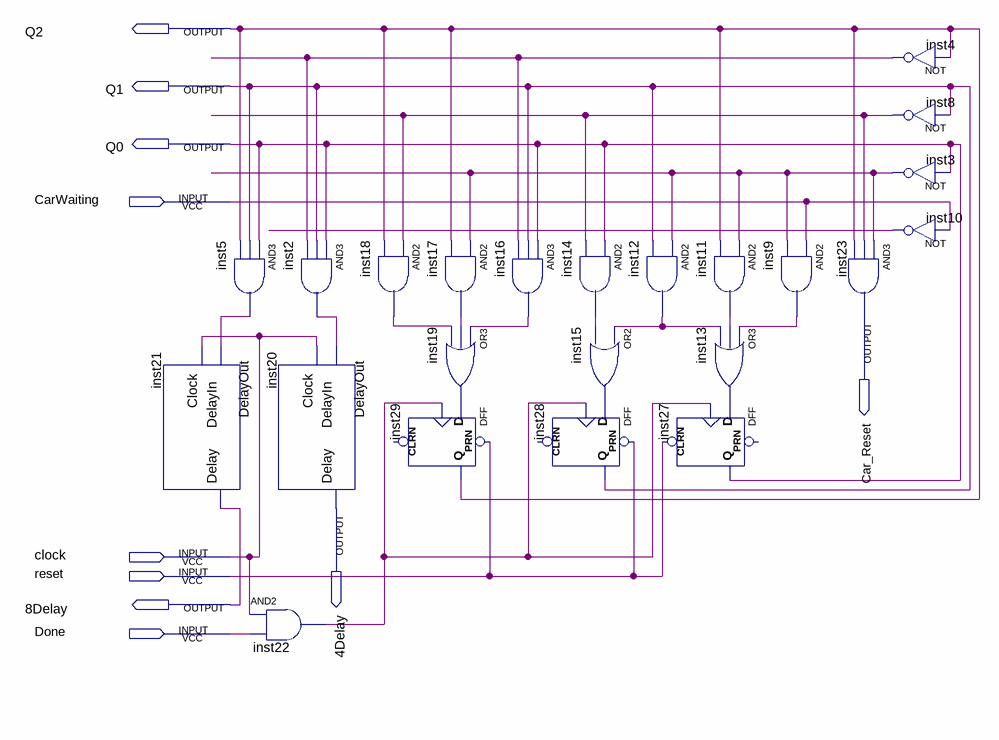
[diagram p0: schematic sheet]
// Quartus schematic TLC2.bdf as structural Verilog: 23 symbols, 10 pins
module TLC2 (
  input  CarWaiting,
  input  clock,
  input  reset,
  input  Done,
  output Q2,
  output Q1,
  output Q0,
  output Car_Reset,
  output \4Delay ,
  output \8Delay 
);

  wire inst2_out, inst3_out, inst4_out, inst5_out, inst8_out, inst9_out, inst10_out, inst11_out, inst12_out,
       inst13_out, inst14_out, inst15_out, inst16_out, inst17_out, inst18_out, inst19_out, inst22_out;

  DelayOut inst21 (.DelayIn(inst5_out), .Clock(clock), .Delay(\8Delay ));
  and inst5 (inst5_out, Q0, Q1, Q2);
  and inst2 (inst2_out, Q0, Q1, inst4_out);
  DelayOut inst20 (.DelayIn(inst2_out), .Clock(clock), .Delay(\4Delay ));
  and inst22 (inst22_out, clock, Done);
  and inst18 (inst18_out, inst8_out, Q2);
  DFF inst29 (.CLK(inst22_out), .D(inst19_out), .PRN(reset), .Q(Q2));  // open: CLRN
  and inst17 (inst17_out, inst3_out, Q2);
  or inst19 (inst19_out, inst16_out, inst17_out, inst18_out);
  and inst16 (inst16_out, Q0, Q1, inst4_out);
  DFF inst28 (.CLK(inst22_out), .D(inst15_out), .PRN(reset), .Q(Q1));  // open: CLRN
  and inst14 (inst14_out, Q0, inst8_out);
  or inst15 (inst15_out, inst12_out, inst14_out);
  and inst11 (inst11_out, inst3_out, Q2);
  and inst12 (inst12_out, inst3_out, Q1);
  or inst13 (inst13_out, inst9_out, inst11_out, inst12_out);
  DFF inst27 (.CLRN(reset), .CLK(inst22_out), .D(inst13_out), .Q(Q0));  // open: PRN
  and inst9 (inst9_out, CarWaiting, inst3_out);
  and inst23 (Car_Reset, inst3_out, inst8_out, Q2);
  not inst4 (inst4_out, Q2);
  not inst8 (inst8_out, Q1);
  not inst3 (inst3_out, Q0);
  not inst10 (inst10_out, CarWaiting);
endmodule
